# EAGLE schematic Final_circuit (EAGLE 9.3.1)
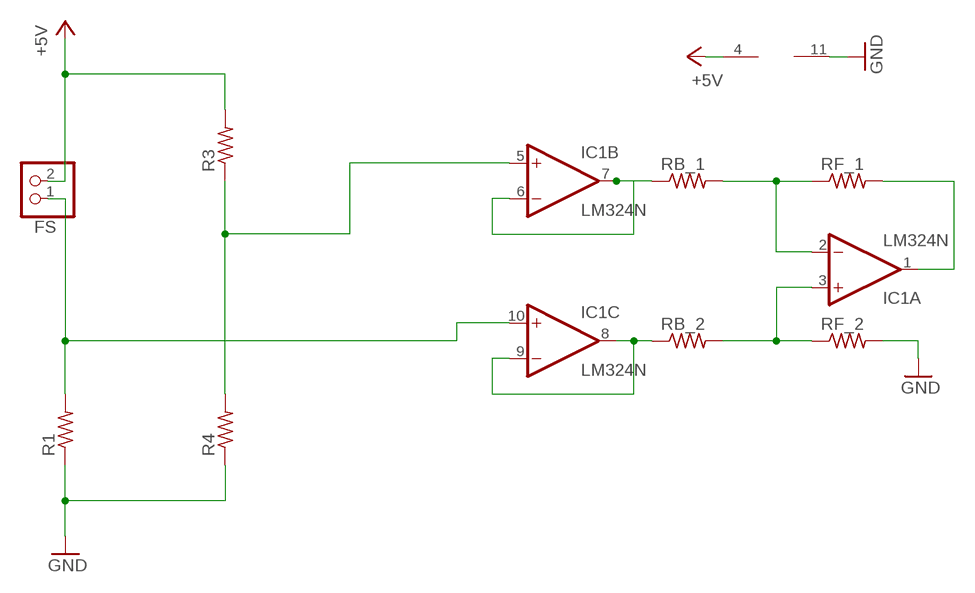
[diagram p0: schematic, sheet 1]

## Parts
FS  PINHD-1X2  [1X02]
IC1  LM324N  [DIL14]
R1  R-US_0207/10  [0207/10]
R3  R-US_0207/10  [0207/10]
R4  R-US_0207/10  [0207/10]
RB_1  R-US_0207/10  [0207/10]
RB_2  R-US_0207/10  [0207/10]
RF_1  R-US_0207/10  [0207/10]
RF_2  R-US_0207/10  [0207/10]

## Nets
+5V: FS.2 IC1.4(P:V+) R3.2
GND: IC1.11(P:V-) R1.1 R4.1 RF_2.2
N$1: FS.1 IC1.10(C:+IN) R1.2
N$2: IC1.6(B:-IN) IC1.7(B:OUT) RB_1.1
N$3: IC1.2(A:-IN) RB_1.2 RF_1.1
N$4: IC1.5(B:+IN) R3.1 R4.2
N$5: IC1.3(A:+IN) RB_2.2 RF_2.1
N$6: IC1.8(C:OUT) IC1.9(C:-IN) RB_2.1
N$10: IC1.1(A:OUT) RF_1.2
Unconnected: IC1.12(D:+IN) IC1.13(D:-IN) IC1.14(D:OUT)

## Library data of the parts
FS = pinhead:PINHD-1X2: PIN HEADER
IC1 = linear:LM324: OP AMP
R1 R3 R4 RB_1 RB_2 RF_1 RF_2 = rcl:R-US_: RESISTOR, American symbol; SPICEPREFIX: R